# EAGLE design Session 4 HW (EAGLE 9.6.2)
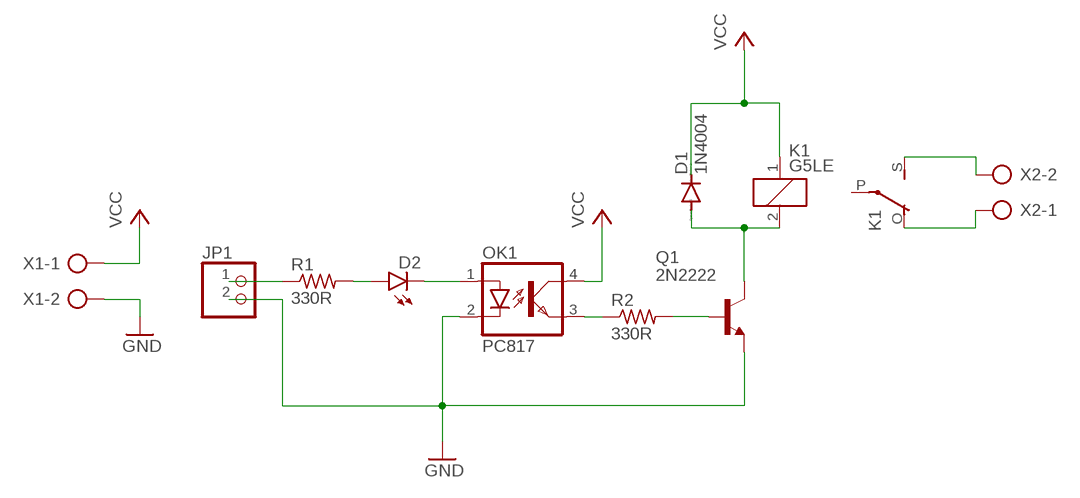
[diagram p0: schematic, sheet 1]

## Parts
D1  1N4004  [DO41-10]
D2  LED5MM  [LED5MM]
JP1  PINHD-1X2  [1X02]
K1  G5LE  [G5LE]
OK1  PC817  [DIL04]
Q1  2N2222  [TO18]
R1  330R  R-US_0204/7  [0204/7]
R2  330R  R-US_0204/7  [0204/7]
X1  AK500/2  [AK500/2]
X2  AK500/2  [AK500/2]

## Nets
GND: JP1.2 OK1.2(C) Q1.1(E) X1.2
N$1: Q1.2(B) R2.2
N$2: D2.A R1.2
N$3: JP1.1 R1.1
N$4: D2.K(C) OK1.1(A)
N$7: OK1.3(EMIT) R2.1
N$8: D1.A K1.2 Q1.3(C)
N$11: K1.S(2:S) X2.2
N$12: K1.O(2:O) X2.1
VCC: D1.C K1.1 OK1.4(COL) X1.1
Unconnected: K1.P(2:P)

## Library data of the parts
D1 = diode:1N4004: DIODE general purpose rectifier, 1 A
D2 = led:LED: LED OSRAM: - CHIPLED LG R971, LG N971, LY N971, LG Q971, LY Q971, LO R971, LY R971 LH N974, LH R974 LS Q976, LO Q976, LY Q976 LO Q996 - Hyper CHIPLED LW Q18S LB Q993, LB Q99A, LB R99A - SideLED LS A670, LO A670, LY A670, LG A670, LP A670 LB A673, LV A673, LT A673, LW A673 LH A674 LY A675 LS A676, LA A676, LO A676, LY A676, LW A676 LS A679, LY A679, LG A679 - Hyper Micro SIDELED® LS Y876, LA Y876, LO Y876, LY Y876 LT Y87S - SmartLED LW L88C, LW L88S LB L89C, LB L89S, LG L890 LS L89K, LO L89K, LY L89K LS L896, LA L896, LO L896, LY L896 - TOPLED LS T670, LO T670, LY T670, LG T670, LP T670 LSG T670, LSP T670, LSY T670, LOP T670, LYG T670 LG T671, LOG T671, LSG T671 LB T673, LV T673, LT T673, LW T673 LH T674 LS T676, LA T676, LO T676, LY T676, LB T676, LH T676, LSB T676, LW T676 LB T67C, LV T67C, LT T67C, LS T67K, LO T67K, LY T67K, LW E67C LS E67B, LA E67B, LO E67B, LY E67B, LB E67C, LV E67C, LT E67C LW T67C LS T679, LY T679, LG T679 LS T770, LO T770, LY T770, LG T770, LP T770 LB T773, LV T773, LT T773, LW T773 LH T774 LS E675, LA E675, LY E675, LS T675 LS T776, LA T776, LO T776, LY T776, LB T776 LHGB T686 LT T68C, LB T68C - Hyper Mini TOPLED® LB M676 - Mini TOPLED Santana® LG M470 LS M47K, LO M47K, LY M47K Source: http://www.osram.convergy.de LUXEON: - LUMILED® LXK2-PW12-R00, LXK2-PW12-S00, LXK2-PW14-U00, LXK2-PW14-V00 LXK2-PM12-R00, LXK2-PM12-S00, LXK2-PM14-U00 LXK2-PE12-Q00, LXK2-PE12-R00, LXK2-PE12-S00, LXK2-PE14-T00, LXK2-PE14-U00 LXK2-PB12-K00, LXK2-PB12-L00, LXK2-PB12-M00, LXK2-PB14-N00, LXK2-PB14-P00, LXK2-PB14-Q00 LXK2-PR12-L00, LXK2-PR12-M00, LXK2-PR14-Q00, LXK2-PR14-R00 LXK2-PD12-Q00, LXK2-PD12-R00, LXK2-PD12-S00 LXK2-PH12-R00, LXK2-PH12-S00 LXK2-PL12-P00, LXK2-PL12-Q00, LXK2-PL12-R00 Source: www.luxeon.com KINGBRIGHT: KA-3528ASYC Source: www.kingbright.com
JP1 = pinhead:PINHD-1X2: PIN HEADER
K1 = relay:G5LE: RELAY 1 x switch, 10 A/120 V AC, 8 A/30 V DC, Omron; OC_FARNELL: unknown; OC_NEWARK: unknown
OK1 = optocoupler:PC817: SHARP OPTO COUPLER; MPN: PC817X4J000F; OC_FARNELL: 9707727; OC_NEWARK: 97K7059
Q1 = transistor-neu-to92:2N2222: NPN TRANSISTOR
R1 R2 = rcl:R-US_: RESISTOR, American symbol; SPICEPREFIX: R
X1 X2 = con-ptr500:AK500/2: CONNECTOR; OC_FARNELL: unknown; OC_NEWARK: unknown

## Board
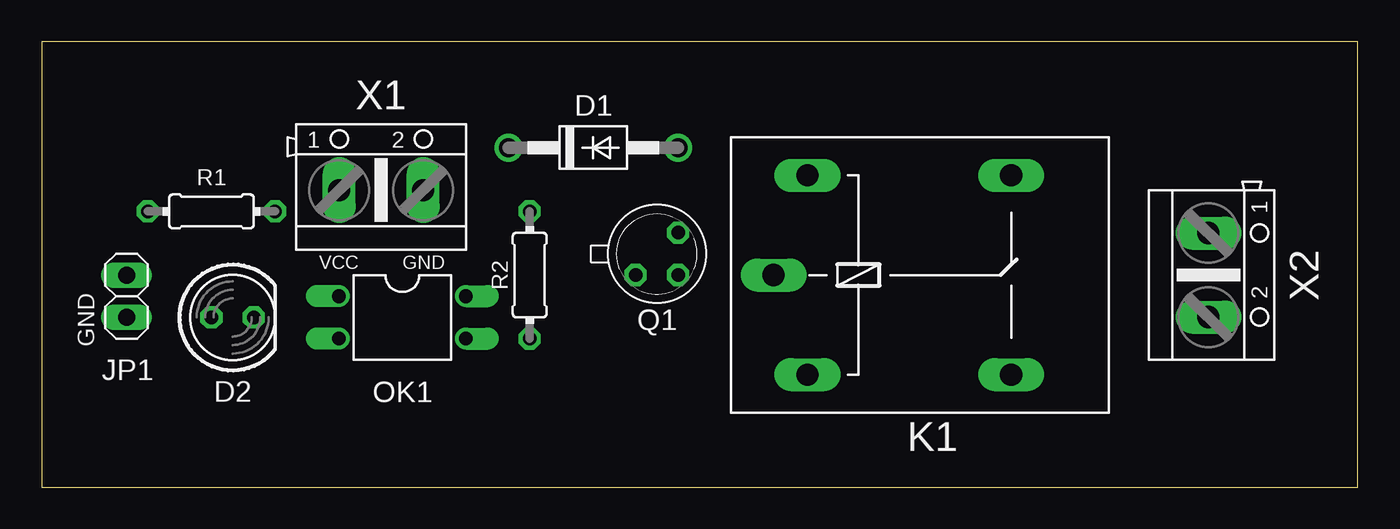
[diagram p1: board, top side]
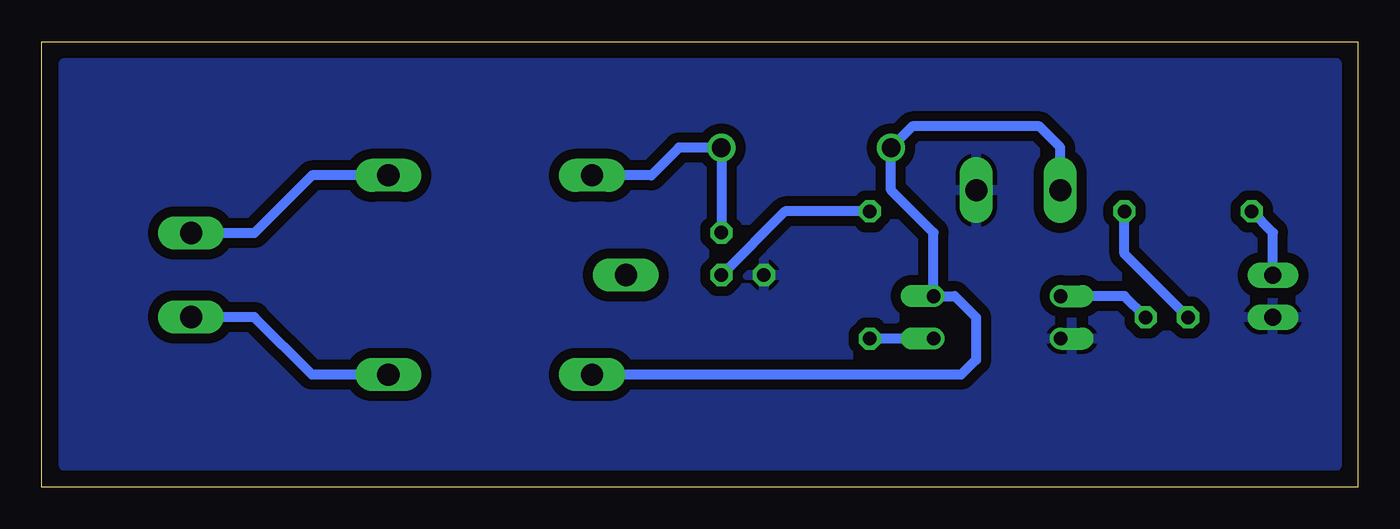
[diagram p2: board, bottom side, seen from below]

Size 78.79 x 26.66 mm. Coordinates in mm from the lower left corner, seen from the top.
Outline: 0,0 78.79,0 78.79,26.66 0,26.66 0,0
Copper layers (1*16): Top 0.035mm / dielectric 1.5mm / Bottom 0.035mm
Design rules "default *": minimum track width 0.6mm, minimum drill 0.6mm, track to track 0.6mm, track to pad 0.6mm, pad to pad 0.6mm, via to via 0.6mm, smd to smd 6mil, copper to edge 0.6mm, drill to drill 0.6mm, minimum pad ring 10mil, minimum via ring 8mil, stop-mask expansion 4mil, vias tented up to drill 0mil, thermal gap 10mil

### Footprints (pad centres in the part's own frame; a part is rotated, then mirrored left to right if it is on the bottom)
DO41-10 = drill 1.118: A 5.08,0; C -5.08,0
LED5MM = drill 0.813 octagon: A -1.27,0; K 1.27,0
1X02 = drill 1.016 long: 1 -1.27,0; 2 1.27,0
G5LE = drill 1.321 long: 1 -7.493,-5.969; 2 -7.493,5.969; O 4.699,5.969; P -9.525,0; S 4.699,-5.969
DIL04 = drill 0.813 offset: 1 -1.27,-3.81; 2 1.27,-3.81; 3 1.27,3.81; 4 -1.27,3.81
TO18 = drill 0.813 octagon: 1 -1.27,-1.27; 2 1.27,-1.27; 3 1.27,1.27
0204/7 = drill 0.813 octagon: 1 -3.81,0; 2 3.81,0
AK500/2 = drill 1.321 long: 1 -2.515,0; 2 2.515,0

### Placement (x,y rotation side)
D1  33.02,20.32 0 top
D2  11.43,10.16 0 top
JP1  5.08,11.43 270 top
K1  53.34,12.7 0 top
OK1  21.59,10.16 270 top
Q1  36.83,13.97 0 top
R1  10.16,16.51 0 top
R2  29.21,12.7 90 top
X1  20.32,17.78 0 top
X2  69.85,12.7 270 top

### Tracks (layer width: path | path; a pad name or v marks a point on that pad's centre or on a via)
GND
  pour Bottom: 1.27,25.4 1.27,1.27 76.2,1.27 77.47,1.27 77.47,25.4
N$1
  Bottom 0.6: R2.2 34.29,16.51 Q1.2
N$2
  Bottom 0.6: D2.A 13.97,13.97 R1.2
N$3
  Bottom 0.6: JP1.1 5.08,15.24 R1.1
N$4
  Bottom 0.6: D2.K 13.97,11.43 OK1.1
N$7
  Bottom 0.6: OK1.3 R2.1
N$8
  Bottom 0.6: Q1.3 D1.A 40.64,20.32 42.29,18.67 K1.2
N$11
  Bottom 0.6: K1.S 62.61,6.73 66.06,10.19 X2.2
N$12
  Bottom 0.6: K1.O 62.61,18.67 66.06,15.22 X2.1
VCC
  Bottom 0.6: X1.1 17.8,20.34 19.05,21.59 26.67,21.59 D1.C 27.94,17.78 25.4,15.24 OK1.4 24.13,11.43 22.86,10.16 22.86,7.62 23.75,6.73 K1.1

### Text on the board
tPlace: VCC | GND | GND